# Altium project PCB_Project2.PrjPCB
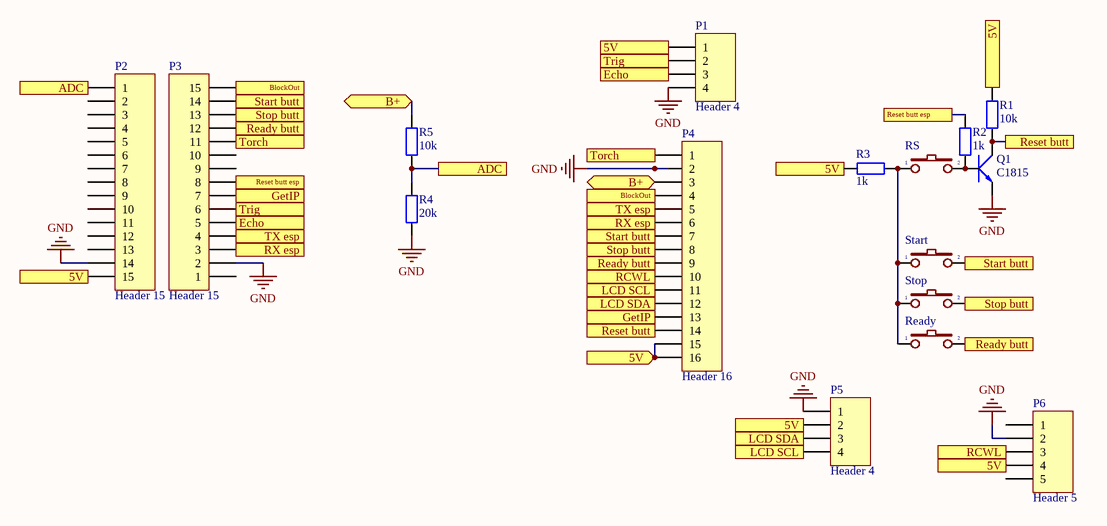
[diagram p0: Sheet2.SchDoc]
1 sheet, 16 parts. Net scope: flat (ports and power ports of the same name join across sheets).
Board file: PCB2.PcbDoc

## Sheet Sheet2.SchDoc
size A

### Parts
P1  Header 4  [HDR1X4]
P2  Header 15  [HDR1X15]
P3  Header 15  [HDR1X15]
P4  Header 16  [HDR1X16]
P5  Header 4  [HDR1X4]
P6  Header 5  [HDR1X5]
Q1  C1815  [QTO-92]
R1  10k  [R1/4W]
R2  1k  [R1/4W]
R3  1k  [R1/4W]
R4  20k  [R1/4W]
R5  10k  [R1/4W]
Ready  SW  [SW2]  (value not drawn)
RS  SW  [SW2]  (value not drawn)
Start  SW  [SW2]  (value not drawn)
Stop  SW  [SW2]  (value not drawn)

### Ports
5V, 5V (in), ADC, B+ (bidir), BlockOut (out), Echo, GetIP, LCD SCL, LCD SDA, RCWL, Ready butt, Reset butt, Reset butt esp, RX esp, Start butt, Stop butt, Torch (in), Trig, TX esp

### Nets
GND: P1.4 P2.14 P3.2 P4.2 P5.1 P6.2 Q1.1(E) R4.2
NetP1_1: P1.1 P2.15 P4.15 P4.16 P5.2 P6.4 R1.1 R3.2 ; port 5V
NetP1_2: P1.2 P3.6 ; port Trig
NetP1_3: P1.3 P3.5 ; port Echo
NetP2_1: P2.1 R4.1 R5.2 ; port ADC
NetP3_3: P3.3 P4.6 ; port RX esp
NetP3_4: P3.4 P4.5 ; port TX esp
NetP3_7: P3.7 P4.13 ; port GetIP
NetP3_8: P3.8 R2.1 ; port Reset butt esp
NetP3_11: P3.11 P4.1 ; port Torch
NetP3_12: P3.12 P4.9 Ready.2 ; port Ready butt
NetP3_13: P3.13 P4.8 Stop.2 ; port Stop butt
NetP3_14: P3.14 P4.7 Start.2 ; port Start butt
NetP3_15: P3.15 P4.4 ; port BlockOut
NetP4_3: P4.3 R5.1 ; port B+
NetP4_10: P4.10 P6.3 ; port RCWL
NetP4_11: P4.11 P5.4 ; port LCD SCL
NetP4_12: P4.12 P5.3 ; port LCD SDA
NetP4_14: P4.14 Q1.2(C) R1.2 ; port Reset butt
NetQ1_3: Q1.3(B) R2.2 RS.2
NetR3_1: R3.1 Ready.1 RS.1 Start.1 Stop.1

Not connected (* = marked no-connect by the designer): P2 2 3 4 5 6 7 8 9 10 11 12 13; P3 1 9 10; P6 1 5

### Library data of the parts
P1 P5 = Header 4: Header, 4-Pin; LatestRevisionDate: 17-Jul-2002; LatestRevisionNote: Re-released for DXP Platform.; Publisher: Altium Limited
P2 P3 = Header 15: Header, 15-Pin; LatestRevisionDate: 17-Jul-2002; LatestRevisionNote: Re-released for DXP Platform.; Publisher: Altium Limited
P4 = Header 16: Header, 16-Pin; LatestRevisionDate: 17-Jul-2002; LatestRevisionNote: Re-released for DXP Platform.; Publisher: Altium Limited
P6 = Header 5: Header, 5-Pin; LatestRevisionDate: 17-Jul-2002; LatestRevisionNote: Re-released for DXP Platform.; Publisher: Altium Limited
Q1 = C1815: NPN 600mW, ECB; Value: C1815
R1-R5 = R1/4W: Resistor 1/4W; Value: R1/4W - 1K
Ready RS Start Stop = SW2: Switch button 2 pin; Value: SW chip 2 pin